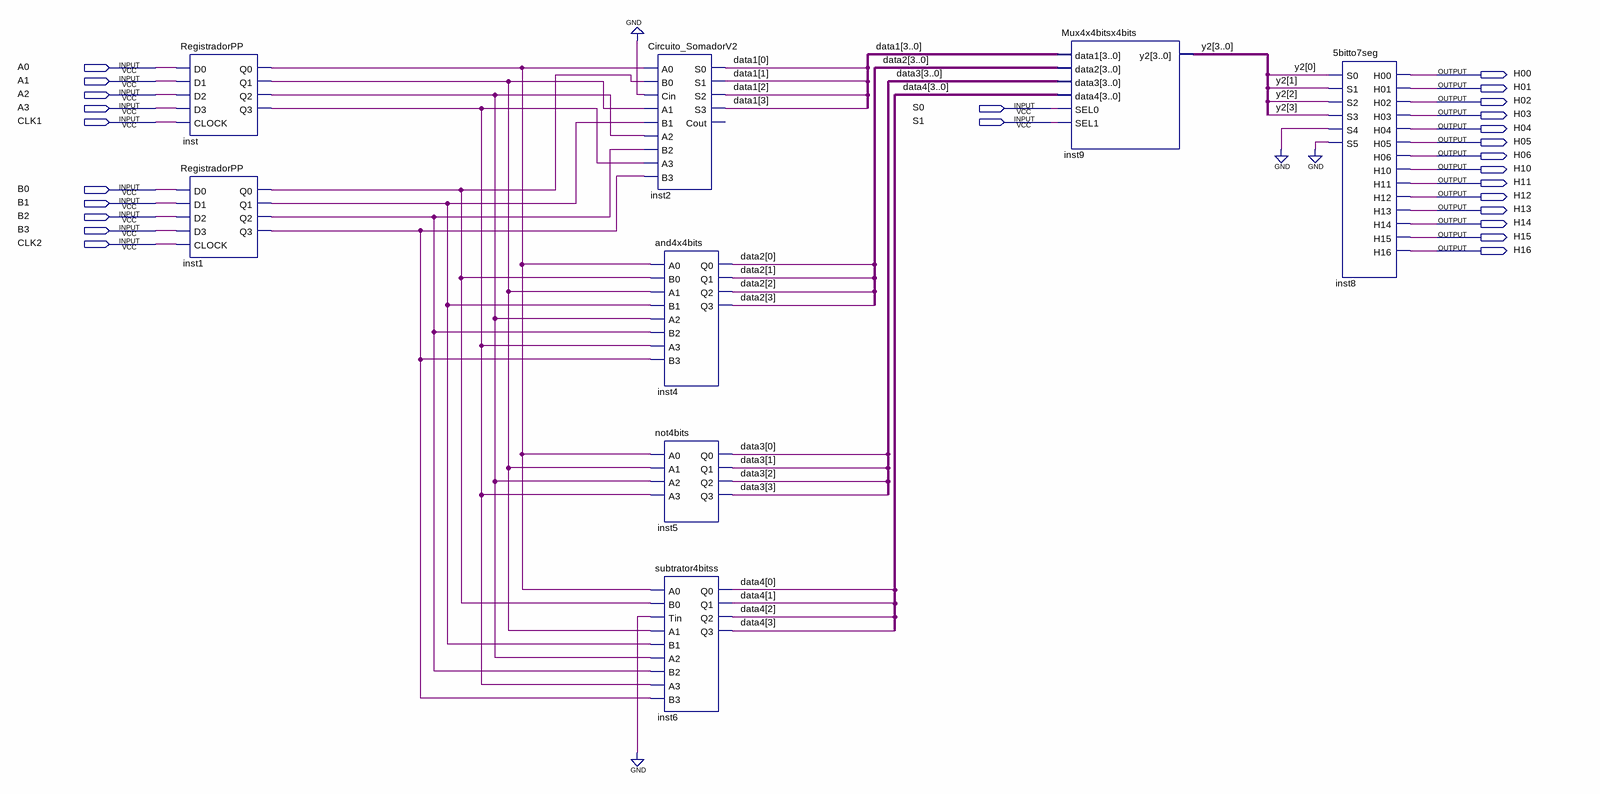
[diagram p0: schematic sheet]
// Quartus schematic ULA.bdf as structural Verilog: 8 symbols, 26 pins
module ULA (
  input  A0,
  input  A1,
  input  A2,
  input  A3,
  input  S0,
  input  CLK1,
  input  S1,
  input  B0,
  input  B1,
  input  B2,
  input  B3,
  input  CLK2,
  output H00,
  output H01,
  output H02,
  output H03,
  output H04,
  output H05,
  output H06,
  output H10,
  output H11,
  output H12,
  output H13,
  output H14,
  output H15,
  output H16
);

  wire inst1_q0, inst1_q1, inst1_q2, inst1_q3, inst_q0, inst_q1, inst_q2, inst_q3;
  wire [3:0] data1, data2, data3, data4, y2;

  RegistradorPP inst (
    .D0(A0), .D1(A1), .D2(A2), .D3(A3), .CLOCK(CLK1), .Q0(inst_q0), .Q1(inst_q1), .Q2(inst_q2), .Q3(inst_q3));
  RegistradorPP inst1 (
    .D0(B0), .D1(B1), .D2(B2), .D3(B3), .CLOCK(CLK2), .Q0(inst1_q0), .Q1(inst1_q1), .Q2(inst1_q2),
    .Q3(inst1_q3));
  Circuito_SomadorV2 inst2 (
    .A0(inst_q0), .B0(inst1_q0), .Cin(1'b0), .A1(inst_q1), .B1(inst1_q1), .A2(inst_q2), .B2(inst1_q2),
    .A3(inst_q3), .B3(inst1_q3), .S0(data1[0]), .S1(data1[1]), .S2(data1[2]), .S3(data1[3]));  // open: Cout
  and4x4bits inst4 (
    .A0(inst_q0), .B0(inst1_q0), .A1(inst_q1), .B1(inst1_q1), .A2(inst_q2), .B2(inst1_q2), .A3(inst_q3),
    .B3(inst1_q3), .Q0(data2[0]), .Q1(data2[1]), .Q2(data2[2]), .Q3(data2[3]));
  not4bits inst5 (
    .A0(inst_q0), .A1(inst_q1), .A2(inst_q2), .A3(inst_q3), .Q0(data3[0]), .Q1(data3[1]), .Q2(data3[2]),
    .Q3(data3[3]));
  subtrator4bitss inst6 (
    .A0(inst_q0), .B0(inst1_q0), .Tin(1'b0), .A1(inst_q1), .B1(inst1_q1), .A2(inst_q2), .B2(inst1_q2),
    .A3(inst_q3), .B3(inst1_q3), .Q0(data4[0]), .Q1(data4[1]), .Q2(data4[2]), .Q3(data4[3]));
  Mux4x4bitsx4bits inst9 (.data1(data1), .data2(data2), .data3(data3), .data4(data4), .SEL0(S0), .SEL1(S1), .y2(y2));
  \5bitto7seg  inst8 (
    .S0(y2[0]), .S1(y2[1]), .S2(y2[2]), .S3(y2[3]), .S4(1'b0), .S5(1'b0), .H00(H00), .H01(H01), .H02(H02),
    .H03(H03), .H04(H04), .H05(H05), .H06(H06), .H10(H10), .H11(H11), .H12(H12), .H13(H13), .H14(H14),
    .H15(H15), .H16(H16));
endmodule
